# EAGLE design coffee machine (EAGLE 9.6.2)
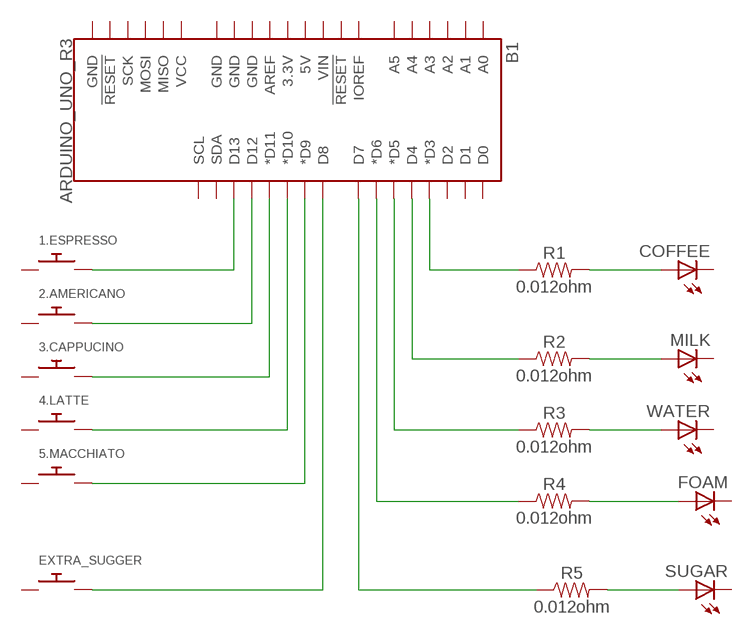
[diagram p0: schematic, sheet 1]

## Parts
1.ESPRESSO  SWITCH_PUSHBUTTONEVQ-PE  [TACT_PANA-EVQ]
2.AMERICANO  SWITCH_PUSHBUTTONEVQ-PE  [TACT_PANA-EVQ]
3.CAPPUCINO  SWITCH_PUSHBUTTONEVQ-PE  [TACT_PANA-EVQ]
4.LATTE  SWITCH_PUSHBUTTONEVQ-PE  [TACT_PANA-EVQ]
5.MACCHIATO  SWITCH_PUSHBUTTONEVQ-PE  [TACT_PANA-EVQ]
B1  ARDUINO_UNO_R3  [ARDUINO_R3]
COFFEE  LED3MM  [LED3MM]
EXTRA_SUGGER  SWITCH_PUSHBUTTONEVQ-PE  [TACT_PANA-EVQ]
FOAM  LED3MM  [LED3MM]
MILK  LED3MM  [LED3MM]
R1  0.012ohm  0.012OHM0603  [0603]
R2  0.012ohm  0.012OHM0603  [0603]
R3  0.012ohm  0.012OHM0603  [0603]
R4  0.012ohm  0.012OHM0603  [0603]
R5  0.012ohm  0.012OHM0603  [0603]
SUGAR  LED3MM  [LED3MM]
WATER  LED3MM  [LED3MM]

## Nets
N$1: 1.ESPRESSO.P$2 B1.D13
N$2: 2.AMERICANO.P$2 B1.D12
N$3: 3.CAPPUCINO.P$2 B1.D11(*D11)
N$4: 4.LATTE.P$2 B1.D10(*D10)
N$5: 5.MACCHIATO.P$2 B1.D9(*D9)
N$6: B1.D8 EXTRA_SUGGER.P$2
N$7: B1.D7 R5.1
N$8: B1.D6(*D6) R4.1
N$9: B1.D5(*D5) R3.1
N$10: B1.D4 R2.1
N$11: B1.D3(*D3) R1.1
N$12: COFFEE.A R1.2
N$13: MILK.A R2.2
N$14: R3.2 WATER.A
N$15: FOAM.A R4.2
N$16: R5.2 SUGAR.A
Unconnected: 1.ESPRESSO.P$1 2.AMERICANO.P$1 3.CAPPUCINO.P$1 4.LATTE.P$1 5.MACCHIATO.P$1 B1.3.3V B1.5V B1.A0 B1.A1 B1.A2 B1.A3 B1.A4 B1.A5 B1.AREF B1.D0 B1.D1 B1.D2 B1.GND@1(GND) B1.GND@2(GND) B1.GND@3(GND) B1.GND@4(GND) B1.IOREF B1.MISO B1.MOSI B1.RESET@1(!RESET!) B1.RESET@2(!RESET!) B1.SCK B1.SCL B1.SDA B1.VCC B1.VIN COFFEE.K(C) EXTRA_SUGGER.P$1 FOAM.K(C) MILK.K(C) SUGAR.K(C) WATER.K(C)

## Library data of the parts
1.ESPRESSO 2.AMERICANO 3.CAPPUCINO 4.LATTE 5.MACCHIATO EXTRA_SUGGER = adafruit:SWITCH_PUSHBUTTON: Buttons SOFTTOUCHSMD_SJ - Soft touch temporary push button (Super Junk Akihabara) Compatible with SKPMANE010 [Mouser: 688-SKPMAN] C&K_KSS = Digikey: KSS221GLFS
B1 = SparkFun-Boards:ARDUINO_UNO_R3: Arduino R3 Footprint with SPI header Arduino Uno R3 Compatible Footprint. Matches PCB size of the original board. SparkFun Products: SAMD21 Dev Breakout <https://www.sparkfun.com/products/13672> RedBoard <https://www.sparkfun.com/products/12757> R3 Stackable Headers <https://www.sparkfun.com/products/11417>
COFFEE FOAM MILK SUGAR WATER = adafruit:LED: LED OSRAM: - CHIPLED LG R971, LG N971, LY N971, LG Q971, LY Q971, LO R971, LY R971 LH N974, LH R974 LS Q976, LO Q976, LY Q976 LO Q996 - Hyper CHIPLED LW Q18S LB Q993, LB Q99A, LB R99A - SideLED LS A670, LO A670, LY A670, LG A670, LP A670 LB A673, LV A673, LT A673, LW A673 LH A674 LY A675 LS A676, LA A676, LO A676, LY A676, LW A676 LS A679, LY A679, LG A679 - Hyper Micro SIDELED® LS Y876, LA Y876, LO Y876, LY Y876 LT Y87S - SmartLED LW L88C, LW L88S LB L89C, LB L89S, LG L890 LS L89K, LO L89K, LY L89K LS L896, LA L896, LO L896, LY L896 - TOPLED LS T670, LO T670, LY T670, LG T670, LP T670 LSG T670, LSP T670, LSY T670, LOP T670, LYG T670 LG T671, LOG T671, LSG T671 LB T673, LV T673, LT T673, LW T673 LH T674 LS T676, LA T676, LO T676, LY T676, LB T676, LH T676, LSB T676, LW T676 LB T67C, LV T67C, LT T67C, LS T67K, LO T67K, LY T67K, LW E67C LS E67B, LA E67B, LO E67B, LY E67B, LB E67C, LV E67C, LT E67C LW T67C LS T679, LY T679, LG T679 LS T770, LO T770, LY T770, LG T770, LP T770 LB T773, LV T773, LT T773, LW T773 LH T774 LS E675, LA E675, LY E675, LS T675 LS T776, LA T776, LO T776, LY T776, LB T776 LHGB T686 LT T68C, LB T68C - Hyper Mini TOPLED® LB M676 - Mini TOPLED Santana® LG M470 LS M47K, LO M47K, LY M47K Source: http://www.osram.convergy.de/
R1-R5 = SparkFun-Resistors:0.012OHM: Generic Resistor Package; PROD_ID: RES-14691

## Board
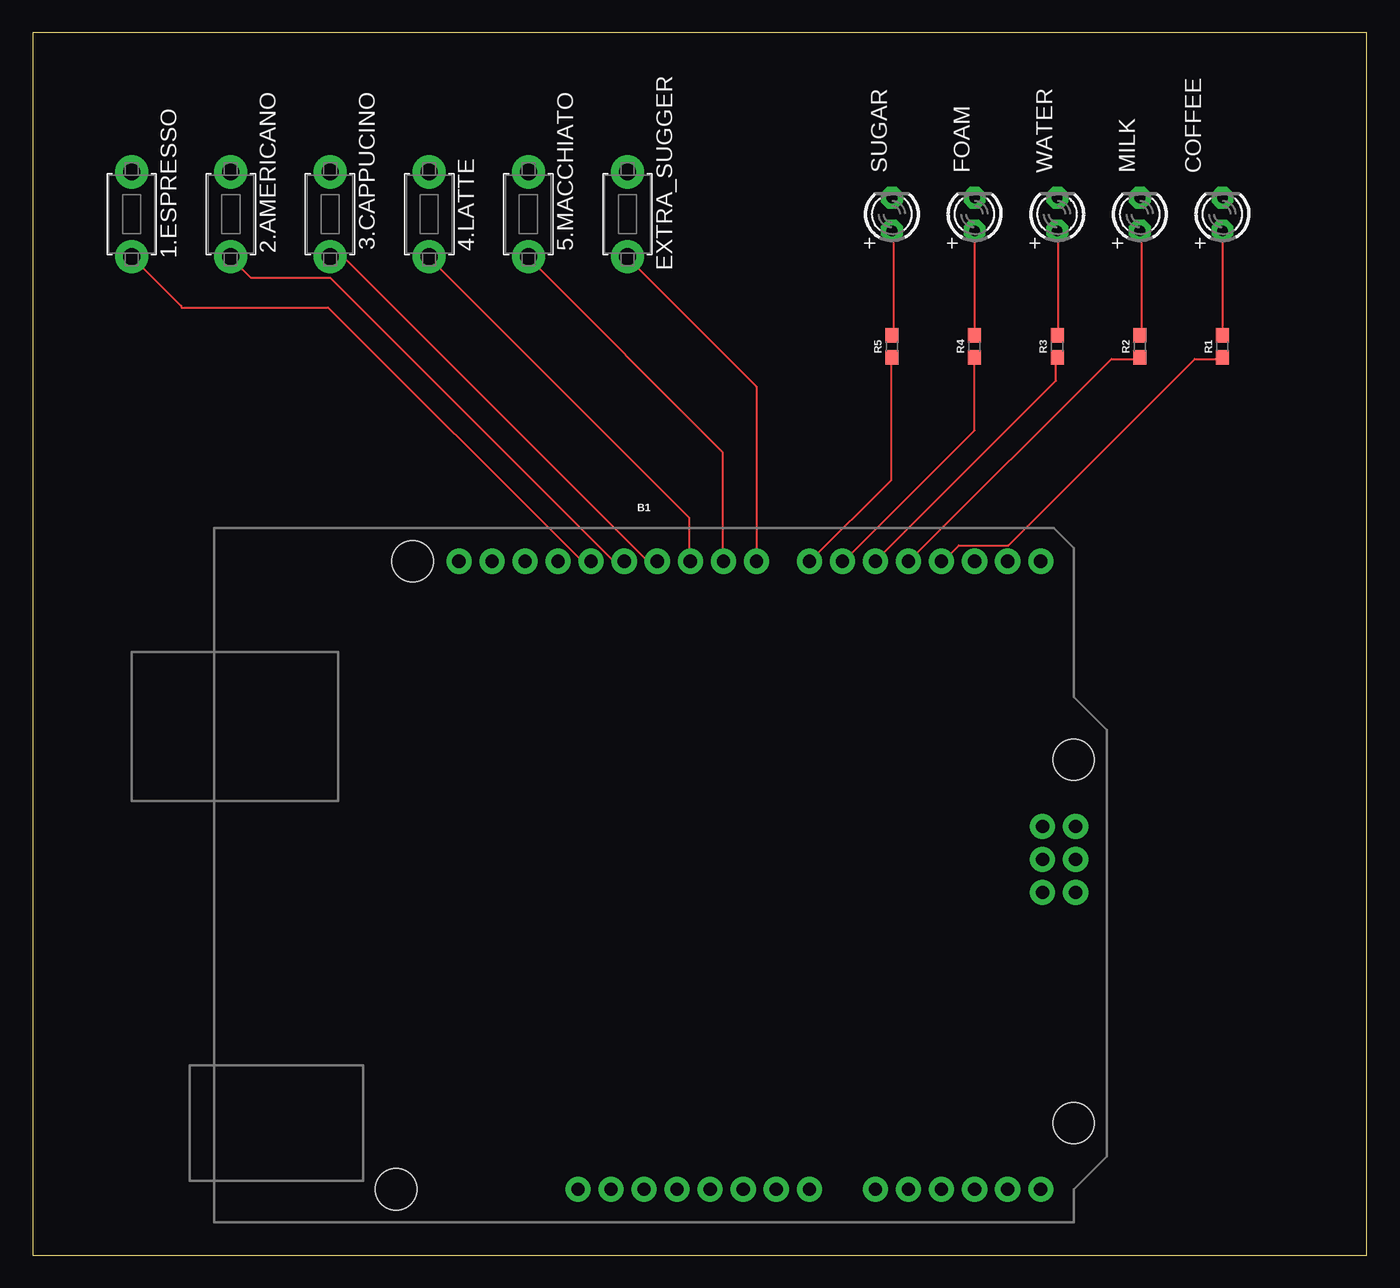
[diagram p1: board, top side]

Size 102.54 x 93.97 mm. Coordinates in mm from the lower left corner, seen from the top.
Outline: 0,0 102.54,0 102.54,93.97 0,93.97 0,0
Copper layers (1*16): Top 0.035mm / dielectric 1.5mm / Bottom 0.035mm
Design rules "default": minimum track width 6mil, minimum drill 0.35mm, track to track 6mil, track to pad 6mil, pad to pad 6mil, via to via 6mil, smd to smd 6mil, copper to edge 40mil, drill to drill 6mil, minimum pad ring 10mil, minimum via ring 8mil, stop-mask expansion 4mil, vias tented up to drill 0mil, thermal gap 10mil

### Footprints (pad centres in the part's own frame; a part is rotated, then mirrored left to right if it is on the bottom)
TACT_PANA-EVQ = drill 1.3 pad 2.54: P$1 -3.25,0; P$2 3.25,0
ARDUINO_R3 = drill 1.016 pad 1.93: 3.3V 2.54,-24.13; 5V 5.08,-24.13; A0 17.78,-24.13; A1 20.32,-24.13; A2 22.86,-24.13; A3 25.4,-24.13; A4 27.94,-24.13; A5 30.48,-24.13; AREF -9.144,24.13; D0 30.48,24.13; D1 27.94,24.13; D2 25.4,24.13; D3 22.86,24.13; D4 20.32,24.13; D5 17.78,24.13; D6 15.24,24.13; D7 12.7,24.13; D8 8.636,24.13; D9 6.096,24.13; D10 3.556,24.13; D11 1.016,24.13; D12 -1.524,24.13; D13 -4.064,24.13; GND@1 7.62,-24.13; GND@2 10.16,-24.13; GND@3 -6.604,24.13; GND@4 33.16,-1.32; IOREF -2.54,-24.13; MISO 30.62,3.76; MOSI 33.16,1.22; NC -5.08,-24.13; RESET@1 0,-24.13; RESET@2 30.62,-1.32; SCK 30.62,1.22; SCL -14.224,24.13; SDA -11.684,24.13; VCC 33.16,3.76; VIN 12.7,-24.13 | hole 3.175: -17.78,24.13; 33.02,8.89; 33.02,-19.05; -19.05,-24.13
LED3MM = drill 0.813 pad 1.676 octagon: A -1.27,0; K 1.27,0
0603 = smd 1.1 x 1: 1 -0.85,0; 2 0.85,0

### Placement (x,y rotation side)
1.ESPRESSO  7.62,80.01 270 top
2.AMERICANO  15.24,80.01 270 top
3.CAPPUCINO  22.86,80.01 270 top
4.LATTE  30.48,80.01 270 top
5.MACCHIATO  38.1,80.01 270 top
B1  46.99,29.21 0 top
COFFEE  91.44,80.01 90 top
EXTRA_SUGGER  45.72,80.01 270 top
FOAM  72.39,80.01 90 top
MILK  85.09,80.01 90 top
R1  91.44,69.85 90 top
R2  85.09,69.85 90 top
R3  78.74,69.85 90 top
R4  72.39,69.85 90 top
R5  66.04,69.85 90 top
SUGAR  66.04,80.01 90 top
WATER  78.74,80.01 90 top

### Tracks (layer width: path | path; a pad name or v marks a point on that pad's centre or on a via)
N$1
  Top 0.152: B1.D13 42.22,53.34 22.71,72.85 11.43,72.85 11.43,72.95 1.ESPRESSO.P$2
N$2
  Top 0.152: B1.D12 44.65,53.34 22.86,75.13 16.76,75.13 15.24,76.66 2.AMERICANO.P$2
N$3
  Top 0.152: B1.D11 47.24,53.34 23.93,76.66 22.86,76.66 3.CAPPUCINO.P$2
N$4
  Top 0.152: B1.D10 50.44,53.34 50.44,56.69 30.48,76.66 4.LATTE.P$2
N$5
  Top 0.152: B1.D9 53.03,53.34 53.03,61.72 38.1,76.66 5.MACCHIATO.P$2
N$6
  Top 0.152: B1.D8 55.63,66.75 45.72,76.66 EXTRA_SUGGER.P$2
N$7
  Top 0.152: R5.1 65.99,68.89 65.99,59.59 59.74,53.34 B1.D7
N$8
  Top 0.152: R4.1 72.39,63.4 62.33,53.34 B1.D6
N$9
  Top 0.152: B1.D5 78.64,67.21 78.64,68.89 R3.1
N$10
  Top 0.152: R2.1 85.04,68.89 82.91,68.89 67.36,53.34 B1.D4
N$11
  Top 0.152: R1.1 91.44,68.89 89.31,68.89 74.98,54.56 71.17,54.56 69.95,53.34 B1.D3
N$12
  Top 0.152: COFFEE.A R1.2
N$13
  Top 0.152: R2.2 85.19,70.71 85.19,78.64 MILK.A
N$14
  Top 0.152: R3.2 78.79,70.71 78.79,78.64 WATER.A
N$15
  Top 0.152: FOAM.A R4.2
N$16
  Top 0.152: R5.2 66.14,70.71 66.14,78.64 SUGAR.A